# EAGLE schematic Rotary_Encoder (EAGLE 6.4)
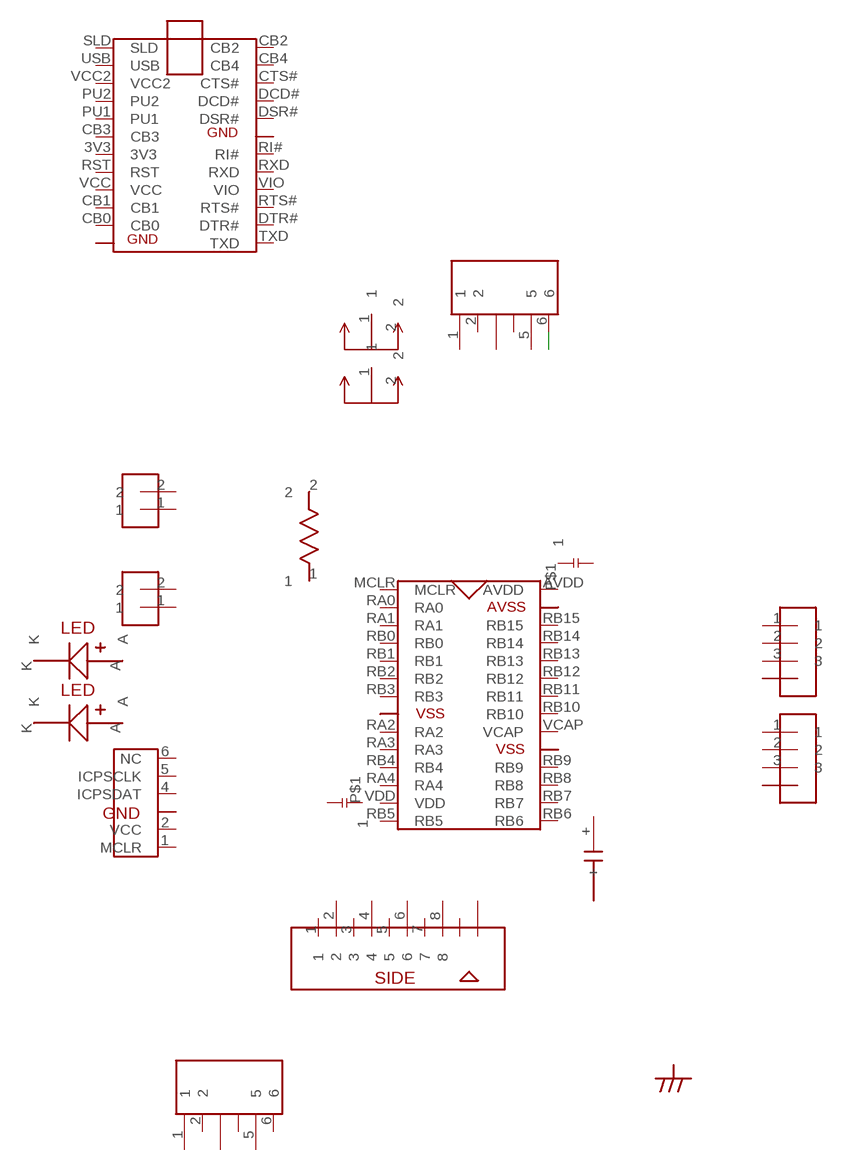
[diagram p0: schematic, sheet 1]

## Parts
CAPACITOR1  CAPACITOR_VCAP  [CAPACITOR_1]
CHIP_CAPACITOR1  CHIP_CAPACITOR  [CHIP_CAPACITOR]
CHIP_CAPACITOR2  CHIP_CAPACITOR  [CHIP_CAPACITOR]
CHIP_REGISTER1  CHIP_REGISTER  [CHIP_REGISTER]
DSPIC33FJ128MC1  DSPIC33FJ128MC  [PIC_28P_2]
HIF3BD-10PA2  HIF3BD-10PA  [HIF3BD-10PA]
LED1  LED_1  [LED_1]
LED2  LED_1  [LED_1]
PICKIT1  PICKIT3_L_REVERSE  [PICKIT3_L_REVERSE]
PINHEADER1  PINHEADER_23  [PINHEADER_2*3]
PINHEADER2  PINHEADER_23  [PINHEADER_2*3]
SLIDE_SWITCH4  SLIDE_SWITCH_3_A_GND  [SLIDE_SWITCH_3_A_GND]
SLIDE_SWITCH5  SLIDE_SWITCH_3_A_GND  [SLIDE_SWITCH_3_A_GND]
USB_SERIAL1  USB_SERIAL(FT232RL)  [USB_SERIAL(FT232RL)]
XH_SIDE_P3  XH_SIDE_P4  [XH_SIDE_4P]
XH_SIDE_P4  XH_SIDE_P4  [XH_SIDE_4P]
XH_SIDE_P5  XH_SIDE_2P  [XH_SIDE_2P]
XH_SIDE_P6  XH_SIDE_2P  [XH_SIDE_2P]

## Nets
N$34: PINHEADER1.6
Unconnected: CAPACITOR1.+ CHIP_CAPACITOR1.P$1 CHIP_CAPACITOR2.P$1 CHIP_REGISTER1.1 CHIP_REGISTER1.2 DSPIC33FJ128MC1.AVDD DSPIC33FJ128MC1.MCLR DSPIC33FJ128MC1.RA0 DSPIC33FJ128MC1.RA1 DSPIC33FJ128MC1.RA2 DSPIC33FJ128MC1.RA3 DSPIC33FJ128MC1.RA4 DSPIC33FJ128MC1.RB0 DSPIC33FJ128MC1.RB1 DSPIC33FJ128MC1.RB2 DSPIC33FJ128MC1.RB3 DSPIC33FJ128MC1.RB4 DSPIC33FJ128MC1.RB5 DSPIC33FJ128MC1.RB6 DSPIC33FJ128MC1.RB7 DSPIC33FJ128MC1.RB8 DSPIC33FJ128MC1.RB9 DSPIC33FJ128MC1.RB10 DSPIC33FJ128MC1.RB11 DSPIC33FJ128MC1.RB12 DSPIC33FJ128MC1.RB13 DSPIC33FJ128MC1.RB14 DSPIC33FJ128MC1.RB15 DSPIC33FJ128MC1.VCAP DSPIC33FJ128MC1.VDD HIF3BD-10PA2.1 HIF3BD-10PA2.2 HIF3BD-10PA2.3 HIF3BD-10PA2.4 HIF3BD-10PA2.5 HIF3BD-10PA2.6 HIF3BD-10PA2.7 HIF3BD-10PA2.8 LED1.A LED1.K LED2.A LED2.K PICKIT1.1(MCLR) PICKIT1.2(VCC) PICKIT1.4(ICPSDAT) PICKIT1.5(ICPSCLK) PICKIT1.6(NC) PINHEADER1.1 PINHEADER1.2 PINHEADER1.5 PINHEADER2.1 PINHEADER2.2 PINHEADER2.5 PINHEADER2.6 SLIDE_SWITCH4.1 SLIDE_SWITCH4.2 SLIDE_SWITCH5.1 SLIDE_SWITCH5.2 USB_SERIAL1.3V3 USB_SERIAL1.CB0 USB_SERIAL1.CB1 USB_SERIAL1.CB2 USB_SERIAL1.CB3 USB_SERIAL1.CB4 USB_SERIAL1.CTS# USB_SERIAL1.DCD# USB_SERIAL1.DSR# USB_SERIAL1.DTR# USB_SERIAL1.PU1 USB_SERIAL1.PU2 USB_SERIAL1.RI# USB_SERIAL1.RST USB_SERIAL1.RTS# USB_SERIAL1.RXD USB_SERIAL1.SLD USB_SERIAL1.TXD USB_SERIAL1.USB USB_SERIAL1.VCC USB_SERIAL1.VCC2 USB_SERIAL1.VIO XH_SIDE_P3.1 XH_SIDE_P3.2 XH_SIDE_P3.3 XH_SIDE_P4.1 XH_SIDE_P4.2 XH_SIDE_P4.3 XH_SIDE_P5.1 XH_SIDE_P5.2 XH_SIDE_P6.1 XH_SIDE_P6.2

## Library data of the parts
CAPACITOR1 = My_Parts:CAPACITOR_VCAP
CHIP_CAPACITOR1 CHIP_CAPACITOR2 = N_Parts:CHIP_CAPACITOR
CHIP_REGISTER1 = N_Parts:CHIP_REGISTER
DSPIC33FJ128MC1 = MicroComputer:DSPIC33FJ128MC
HIF3BD-10PA2 = N_Connector:HIF3BD-10PA
LED1 LED2 = N_Parts:LED_1
PICKIT1 = N_Parts:PICKIT3_L_REVERSE
PINHEADER1 PINHEADER2 = N_Pinheader:PINHEADER_2*3
SLIDE_SWITCH4 SLIDE_SWITCH5 = N_Switch:SLIDE_SWITCH_3_A_GND
USB_SERIAL1 = N_Parts:USB_SERIAL(FT232RL)
XH_SIDE_P3 XH_SIDE_P4 = N_Connector:XH_SIDE_P4
XH_SIDE_P5 XH_SIDE_P6 = N_Connector:XH_SIDE_2P